# Altium schematic sheet Strain In.SchDoc
size A4; SheetNumber: 8; SheetTotal: 9
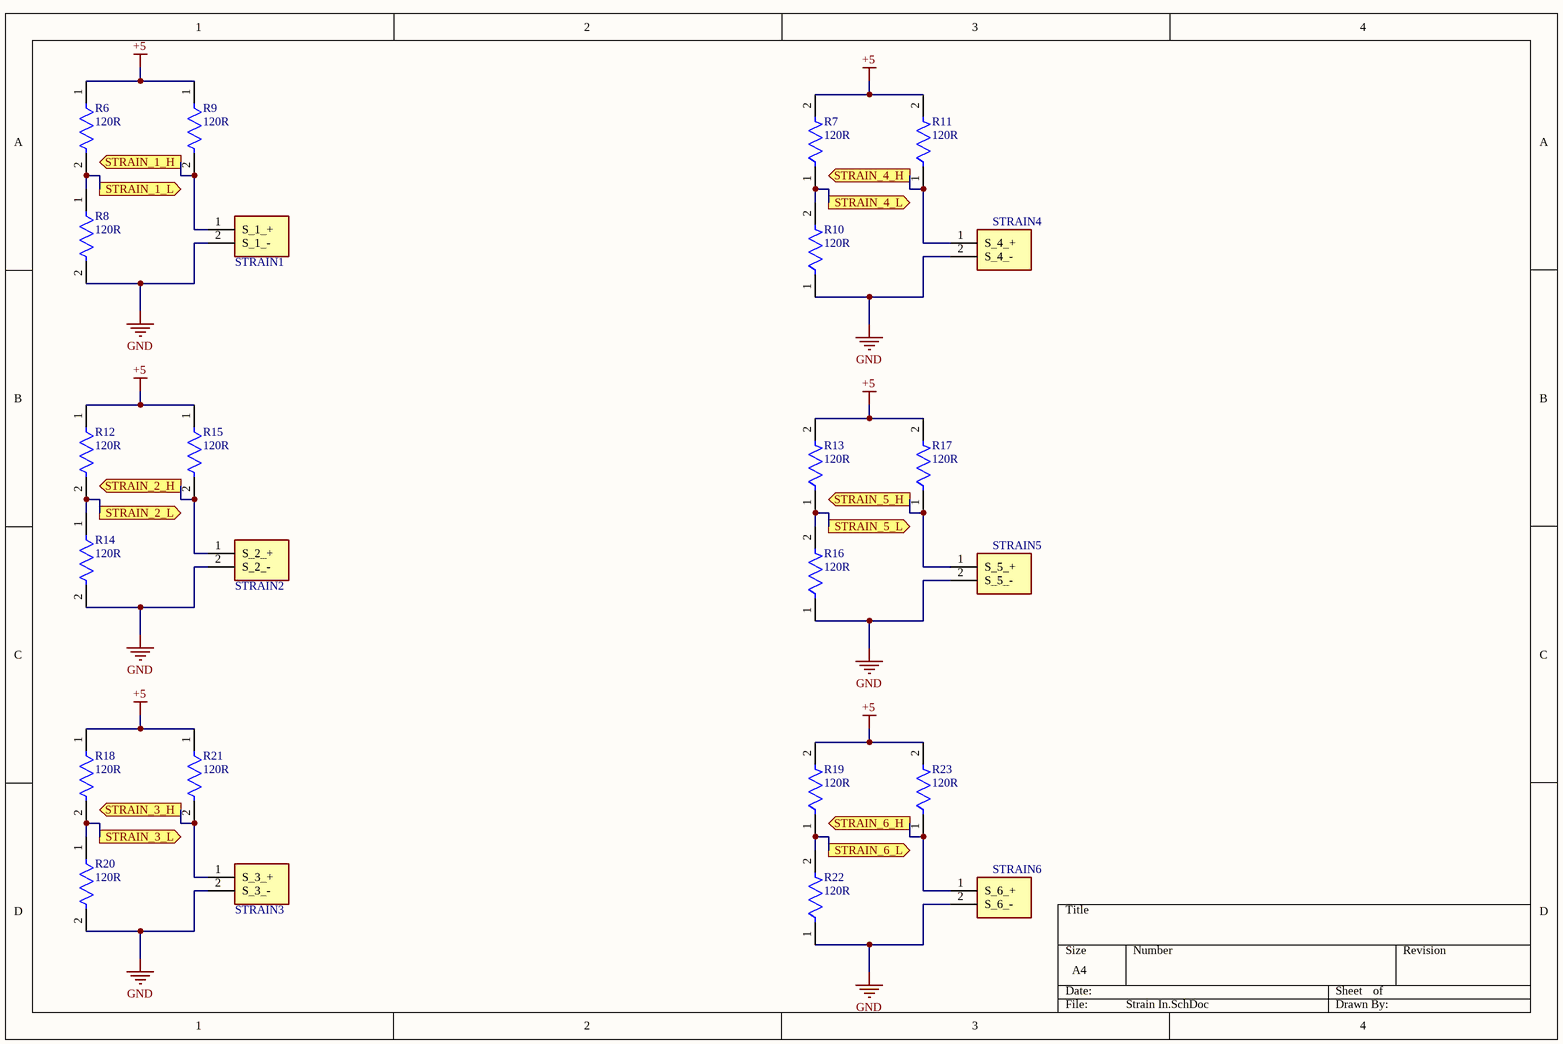
[diagram p0: Strain In.SchDoc]

## Parts
R6  120R  [FP-CRCW1206-e3-MFG]
R7  120R  [FP-CRCW1206-e3-MFG]
R8  120R  [FP-CRCW1206-e3-MFG]
R9  120R  [FP-CRCW1206-e3-MFG]
R10  120R  [FP-CRCW1206-e3-MFG]
R11  120R  [FP-CRCW1206-e3-MFG]
R12  120R  [FP-CRCW1206-e3-MFG]
R13  120R  [FP-CRCW1206-e3-MFG]
R14  120R  [FP-CRCW1206-e3-MFG]
R15  120R  [FP-CRCW1206-e3-MFG]
R16  120R  [FP-CRCW1206-e3-MFG]
R17  120R  [FP-CRCW1206-e3-MFG]
R18  120R  [FP-CRCW1206-e3-MFG]
R19  120R  [FP-CRCW1206-e3-MFG]
R20  120R  [FP-CRCW1206-e3-MFG]
R21  120R  [FP-CRCW1206-e3-MFG]
R22  120R  [FP-CRCW1206-e3-MFG]
R23  120R  [FP-CRCW1206-e3-MFG]
STRAIN1  171971-0002  [SHDR2W65P0X254_1X2_738X510X1216P]  (value not drawn)
STRAIN2  171971-0002  [SHDR2W65P0X254_1X2_738X510X1216P]  (value not drawn)
STRAIN3  171971-0002  [SHDR2W65P0X254_1X2_738X510X1216P]  (value not drawn)
STRAIN4  171971-0002  [SHDR2W65P0X254_1X2_738X510X1216P]  (value not drawn)
STRAIN5  171971-0002  [SHDR2W65P0X254_1X2_738X510X1216P]  (value not drawn)
STRAIN6  171971-0002  [SHDR2W65P0X254_1X2_738X510X1216P]  (value not drawn)

## Ports
STRAIN_1_H (out), STRAIN_1_L (out), STRAIN_2_H (out), STRAIN_2_L (out), STRAIN_3_H (out), STRAIN_3_L (out), STRAIN_4_H (out), STRAIN_4_L (out), STRAIN_5_H (out), STRAIN_5_L (out), STRAIN_6_H (out), STRAIN_6_L (out)

## Nets
+5: R6.1 R7.2 R9.1 R11.2 R12.1 R13.2 R15.1 R17.2 R18.1 R19.2 R21.1 R23.2
GND: R8.2 R10.1 R14.2 R16.1 R20.2 R22.1 STRAIN1.2(S_1_-) STRAIN2.2(S_2_-) STRAIN3.2(S_3_-) STRAIN4.2(S_4_-) STRAIN5.2(S_5_-) STRAIN6.2(S_6_-)
STRAIN_1_H: R9.2 STRAIN1.1(S_1_+) ; port STRAIN_1_H
STRAIN_1_L: R6.2 R8.1 ; port STRAIN_1_L
STRAIN_2_H: R15.2 STRAIN2.1(S_2_+) ; port STRAIN_2_H
STRAIN_2_L: R12.2 R14.1 ; port STRAIN_2_L
STRAIN_3_H: R21.2 STRAIN3.1(S_3_+) ; port STRAIN_3_H
STRAIN_3_L: R18.2 R20.1 ; port STRAIN_3_L
STRAIN_4_H: R11.1 STRAIN4.1(S_4_+) ; port STRAIN_4_H
STRAIN_4_L: R7.1 R10.2 ; port STRAIN_4_L
STRAIN_5_H: R17.1 STRAIN5.1(S_5_+) ; port STRAIN_5_H
STRAIN_5_L: R13.1 R16.2 ; port STRAIN_5_L
STRAIN_6_H: R23.1 STRAIN6.1(S_6_+) ; port STRAIN_6_H
STRAIN_6_L: R19.1 R22.2 ; port STRAIN_6_L

## Library data of the parts
R6-R23 = CMP-2003-04838-2: RES Thick Film, 120Ω, 1%, 0.25W, 100ppm/°C, 1206; Power Rating: 250mW; Voltage Rating: 200V; Length: 3.2mm; Tolerance: 1%; Weight: 0.000353oz; Temperature Coefficient: 100ppm/°C; Case/Package: 1206; Lead Free: Lead Free; Case Code (Metric): 3216; Min Operating Temperature: -55°C; Package Quantity: 10; Mount: Surface Mount; Height: 0.55mm; Packaging: Tape and Reel; Number of Terminations: 2; Composition: Thick Film; Width: 0.063inch; Voltage Rating (DC): 200V; Radiation Hardening: No; Contact Plating: Tin; Resistance: 120R; Case Code (Imperial): 1206; Termination: SMD/SMT; Max Power Dissipation: 250mW; Features: Automotive AEC-Q200; Military Standard: Not; Depth: 1.6mm; Max Operating Temperature: 155°C
STRAIN1-STRAIN6 = 171971-0002: Connector; Manufacturer_Name: Molex; Datasheet Link: https://componentsearchengine.com//171971-0002.pdf; Height: 12.16mm; Mouser2 Part Number: 538-171971-0002; Mouser2 Price/Stock: https://www.mouser.com/Search/Refine.aspx?Keyword=538-171971-0002; Manufacturer_Part_Number: 171971-0002